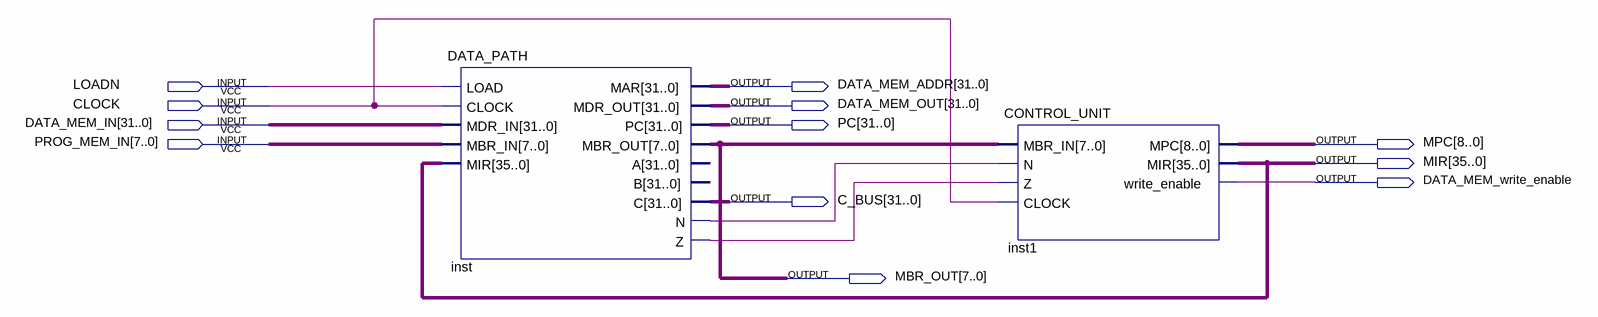
[diagram p0: schematic sheet]
// Quartus schematic CPU.bdf as structural Verilog: 2 symbols, 12 pins
module CPU (
  input  LOADN,
  input  CLOCK,
  input  [31:0] DATA_MEM_IN,
  input  [7:0] PROG_MEM_IN,
  output [31:0] DATA_MEM_ADDR,
  output [31:0] DATA_MEM_OUT,
  output [31:0] PC,
  output [8:0] MPC,
  output [35:0] MIR,
  output DATA_MEM_write_enable,
  output [31:0] C_BUS,
  output [7:0] MBR_OUT
);

  wire inst_n, inst_z;

  DATA_PATH inst (
    .LOAD(LOADN), .CLOCK(CLOCK), .MDR_IN(DATA_MEM_IN), .MBR_IN(PROG_MEM_IN), .MIR(MIR), .MAR(DATA_MEM_ADDR),
    .MDR_OUT(DATA_MEM_OUT), .PC(PC), .MBR_OUT(MBR_OUT), .C(C_BUS), .N(inst_n), .Z(inst_z));  // open: A, B
  CONTROL_UNIT inst1 (
    .MBR_IN(MBR_OUT), .N(inst_n), .Z(inst_z), .CLOCK(CLOCK), .MPC(MPC), .MIR(MIR),
    .write_enable(DATA_MEM_write_enable));
endmodule
